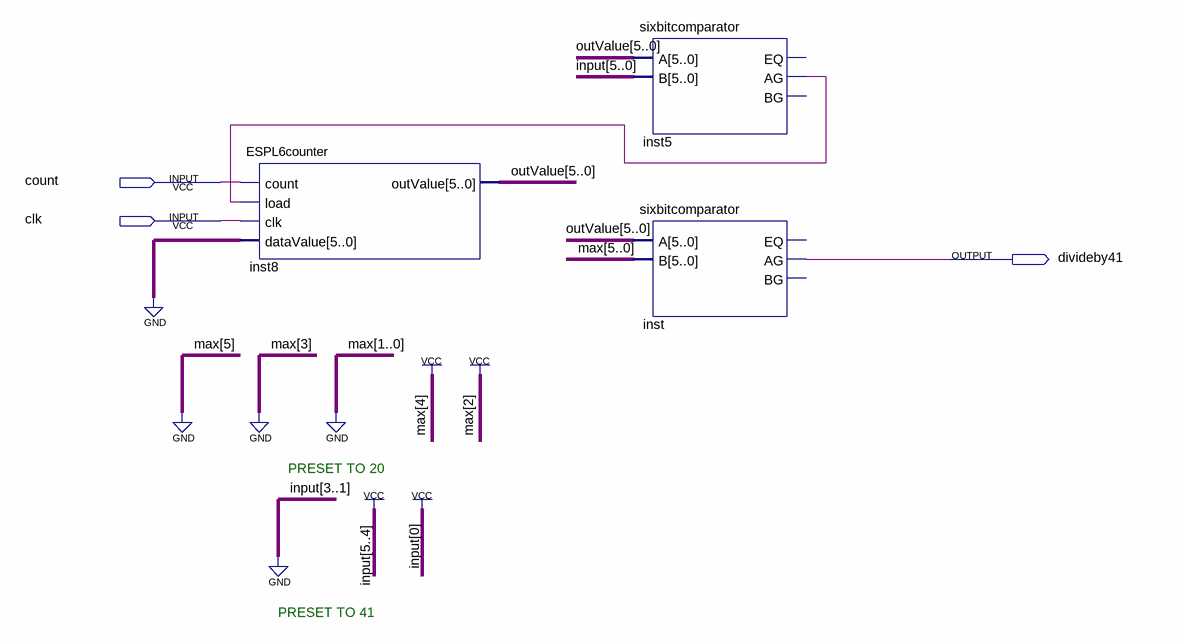
[diagram p0: schematic sheet]
// Quartus schematic Divideby41.bdf as structural Verilog: 3 symbols, 3 pins
module Divideby41 (
  input  count,
  input  clk,
  output divideby41
);

  wire inst5_ag;
  wire [5:0] outValue;

  ESPL6counter inst8 (.count(count), .load(inst5_ag), .clk(clk), .dataValue({6{1'b0}}), .outValue(outValue));
  sixbitcomparator inst5 (.A(outValue), .B(6'b110001), .AG(inst5_ag));  // open: EQ, BG
  sixbitcomparator inst (.A(outValue), .B(6'b010100), .AG(divideby41));  // open: EQ, BG

  // Notes on the sheet:
  //   PRESET TO 20
  //   PRESET TO 41
endmodule
